# EAGLE design KeyJam Header (EAGLE 9.6.2)
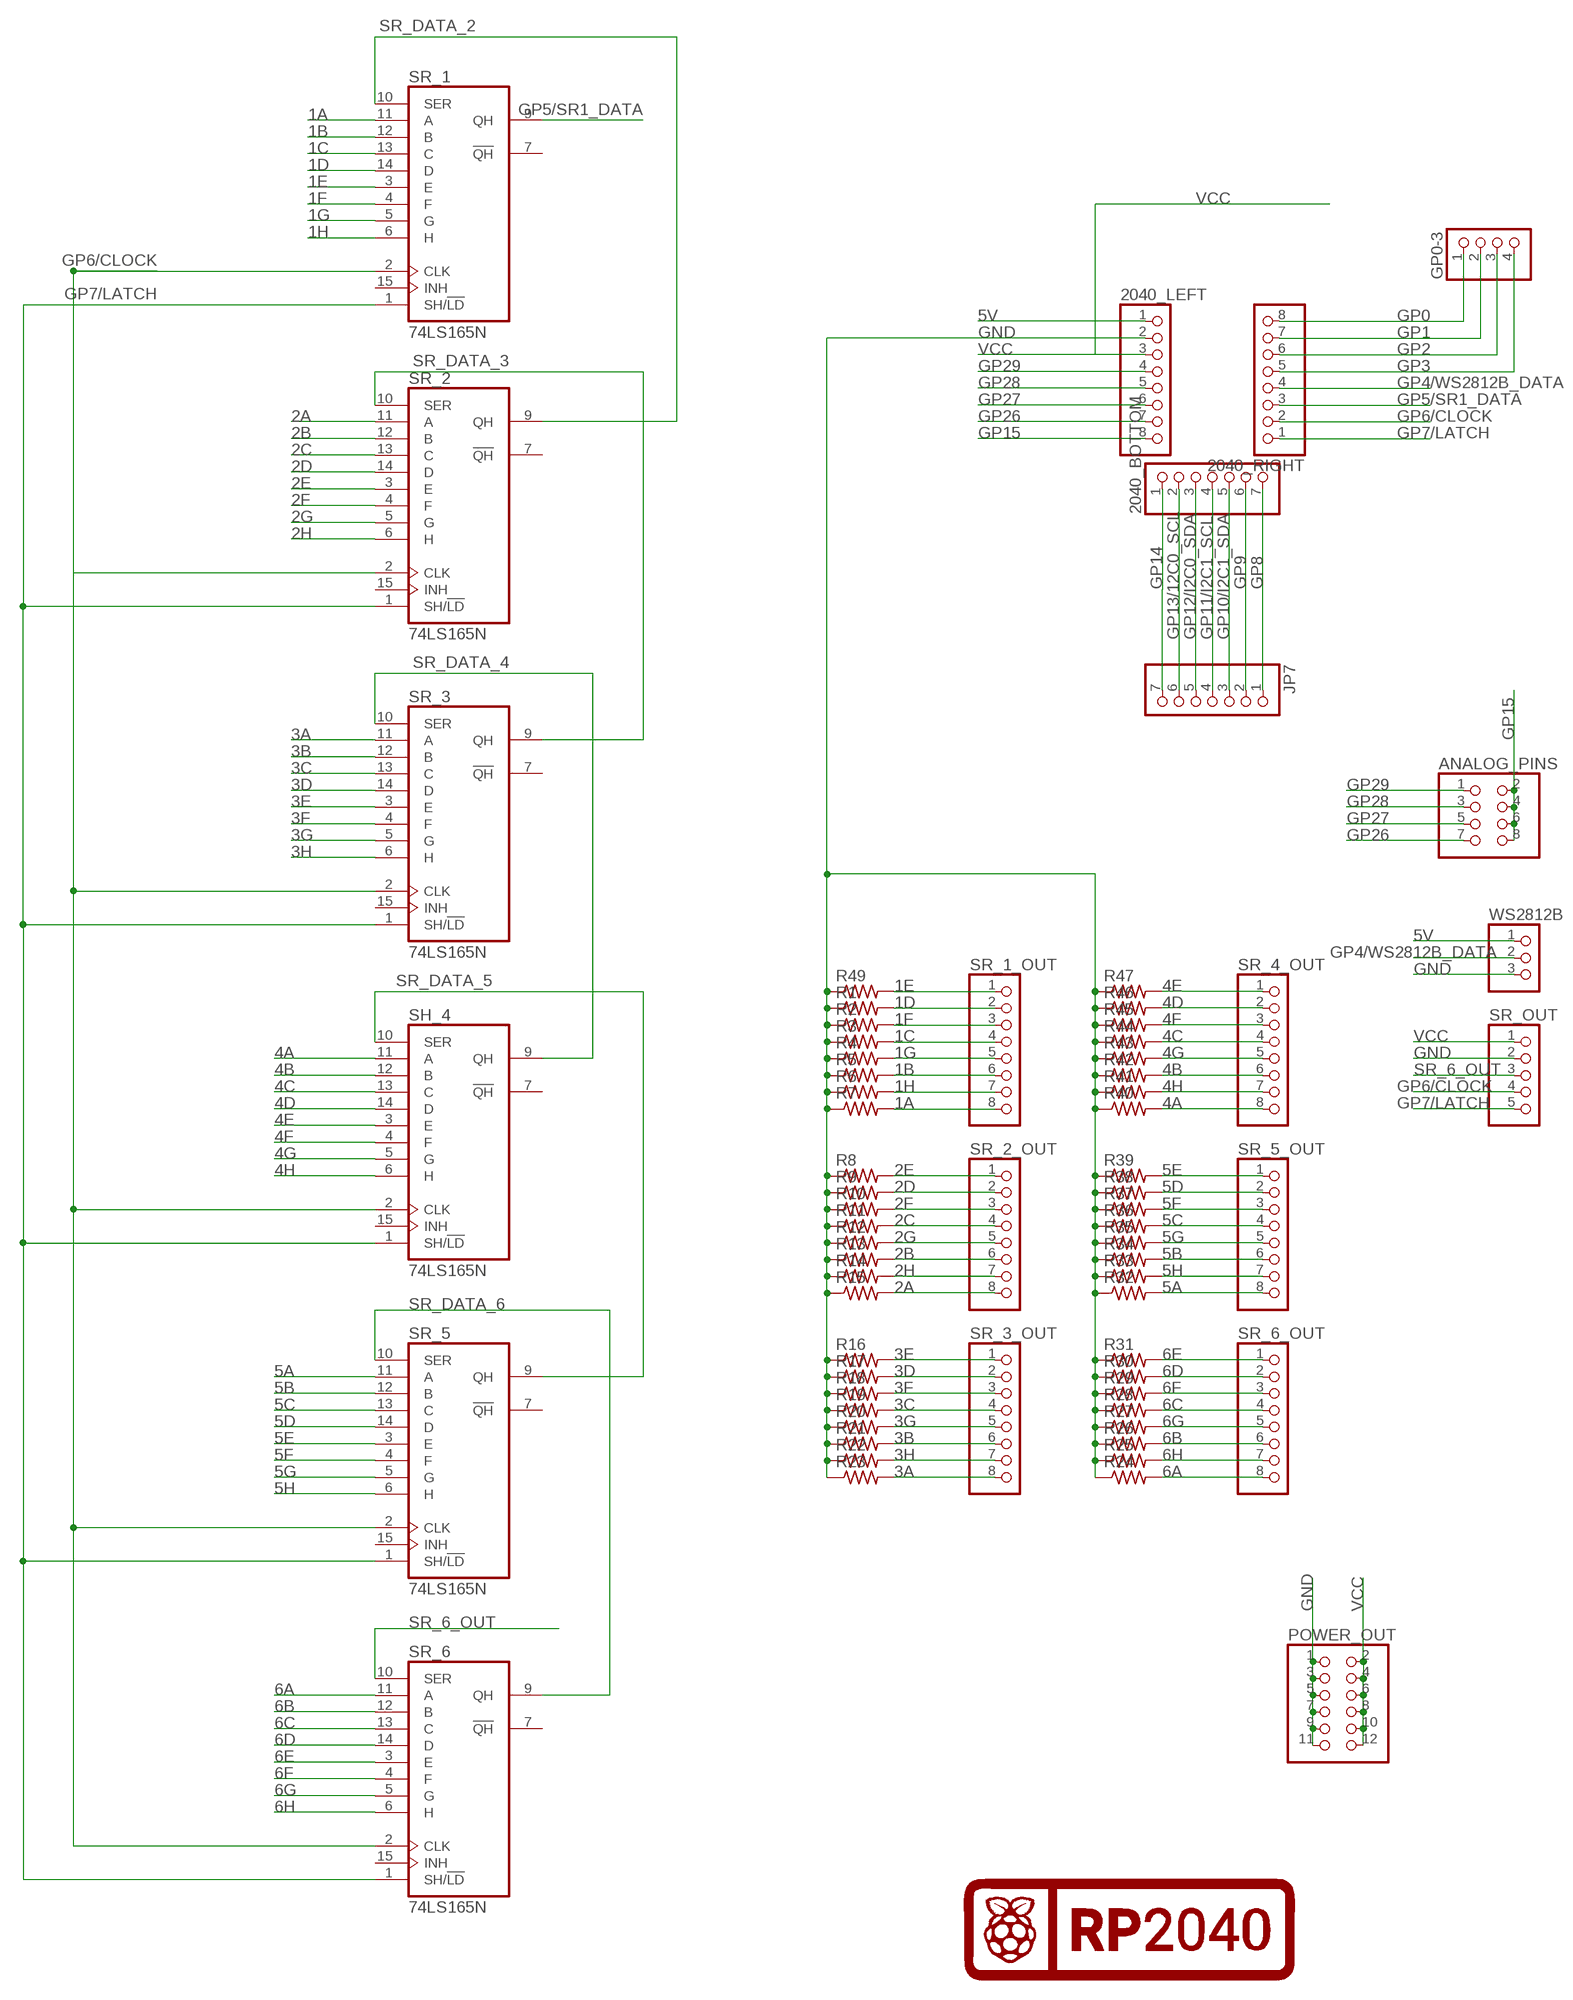
[diagram p0: schematic, sheet 1]

## Parts
2040_BOTTOM  PINHD-1X7  [1X07]
2040_LEFT  PINHD-1X8  [1X08]
2040_RIGHT  PINHD-1X8  [1X08]
ANALOG_PINS  PINHD-2X4  [2X04]
GP0-3  PINHD-1X4  [1X04]
JP7  PINHD-1X7  [1X07]
POWER_OUT  PINHD-2X6  [2X06]
R1  R-US_R1206  [R1206]
R2  R-US_R1206  [R1206]
R3  R-US_R1206  [R1206]
R4  R-US_R1206  [R1206]
R5  R-US_R1206  [R1206]
R6  R-US_R1206  [R1206]
R7  R-US_R1206  [R1206]
R8  R-US_R1206  [R1206]
R9  R-US_R1206  [R1206]
R10  R-US_R1206  [R1206]
R11  R-US_R1206  [R1206]
R12  R-US_R1206  [R1206]
R13  R-US_R1206  [R1206]
R14  R-US_R1206  [R1206]
R15  R-US_R1206  [R1206]
R16  R-US_R1206  [R1206]
R17  R-US_R1206  [R1206]
R18  R-US_R1206  [R1206]
R19  R-US_R1206  [R1206]
R20  R-US_R1206  [R1206]
R21  R-US_R1206  [R1206]
R22  R-US_R1206  [R1206]
R23  R-US_R1206  [R1206]
R24  R-US_R1206  [R1206]
R25  R-US_R1206  [R1206]
R26  R-US_R1206  [R1206]
R27  R-US_R1206  [R1206]
R28  R-US_R1206  [R1206]
R29  R-US_R1206  [R1206]
R30  R-US_R1206  [R1206]
R31  R-US_R1206  [R1206]
R32  R-US_R1206  [R1206]
R33  R-US_R1206  [R1206]
R34  R-US_R1206  [R1206]
R35  R-US_R1206  [R1206]
R36  R-US_R1206  [R1206]
R37  R-US_R1206  [R1206]
R38  R-US_R1206  [R1206]
R39  R-US_R1206  [R1206]
R40  R-US_R1206  [R1206]
R41  R-US_R1206  [R1206]
R42  R-US_R1206  [R1206]
R43  R-US_R1206  [R1206]
R44  R-US_R1206  [R1206]
R45  R-US_R1206  [R1206]
R46  R-US_R1206  [R1206]
R47  R-US_R1206  [R1206]
R49  R-US_R1206  [R1206]
SH_4  74LS165N  [DIL16]
SR_1  74LS165N  [DIL16]
SR_1_OUT  PINHD-1X8  [1X08]
SR_2  74LS165N  [DIL16]
SR_2_OUT  PINHD-1X8  [1X08]
SR_3  74LS165N  [DIL16]
SR_3_OUT  PINHD-1X8  [1X08]
SR_4_OUT  PINHD-1X8  [1X08]
SR_5  74LS165N  [DIL16]
SR_5_OUT  PINHD-1X8  [1X08]
SR_6  74LS165N  [DIL16]
SR_6_OUT  PINHD-1X8  [1X08]
SR_OUT  PINHD-1X5  [1X05]
U$1  RASPI_RP2040_LOGO_20MM  [RASPI_RP2040_LOGO_20MM]
WS2812B  PINHD-1X3  [1X03]

## Nets
1A: R7.2 SR_1.11(A) SR_1_OUT.8
1B: R5.2 SR_1.12(B) SR_1_OUT.6
1C: R3.2 SR_1.13(C) SR_1_OUT.4
1D: R1.2 SR_1.14(D) SR_1_OUT.2
1E: R49.2 SR_1.3(E) SR_1_OUT.1
1F: R2.2 SR_1.4(F) SR_1_OUT.3
1G: R4.2 SR_1.5(G) SR_1_OUT.5
1H: R6.2 SR_1.6(H) SR_1_OUT.7
2A: R15.2 SR_2.11(A) SR_2_OUT.8
2B: R13.2 SR_2.12(B) SR_2_OUT.6
2C: R11.2 SR_2.13(C) SR_2_OUT.4
2D: R9.2 SR_2.14(D) SR_2_OUT.2
2E: R8.2 SR_2.3(E) SR_2_OUT.1
2F: R10.2 SR_2.4(F) SR_2_OUT.3
2G: R12.2 SR_2.5(G) SR_2_OUT.5
2H: R14.2 SR_2.6(H) SR_2_OUT.7
3A: R23.2 SR_3.11(A) SR_3_OUT.8
3B: R21.2 SR_3.12(B) SR_3_OUT.6
3C: R19.2 SR_3.13(C) SR_3_OUT.4
3D: R17.2 SR_3.14(D) SR_3_OUT.2
3E: R16.2 SR_3.3(E) SR_3_OUT.1
3F: R18.2 SR_3.4(F) SR_3_OUT.3
3G: R20.2 SR_3.5(G) SR_3_OUT.5
3H: R22.2 SR_3.6(H) SR_3_OUT.7
4A: R40.2 SH_4.11(A) SR_4_OUT.8
4B: R42.2 SH_4.12(B) SR_4_OUT.6
4C: R44.2 SH_4.13(C) SR_4_OUT.4
4D: R46.2 SH_4.14(D) SR_4_OUT.2
4E: R47.2 SH_4.3(E) SR_4_OUT.1
4F: R45.2 SH_4.4(F) SR_4_OUT.3
4G: R43.2 SH_4.5(G) SR_4_OUT.5
4H: R41.2 SH_4.6(H) SR_4_OUT.7
5A: R32.2 SR_5.11(A) SR_5_OUT.8
5B: R34.2 SR_5.12(B) SR_5_OUT.6
5C: R36.2 SR_5.13(C) SR_5_OUT.4
5D: R38.2 SR_5.14(D) SR_5_OUT.2
5E: R39.2 SR_5.3(E) SR_5_OUT.1
5F: R37.2 SR_5.4(F) SR_5_OUT.3
5G: R35.2 SR_5.5(G) SR_5_OUT.5
5H: R33.2 SR_5.6(H) SR_5_OUT.7
5V: 2040_LEFT.1 WS2812B.1
6A: R24.2 SR_6.11(A) SR_6_OUT.8
6B: R26.2 SR_6.12(B) SR_6_OUT.6
6C: R28.2 SR_6.13(C) SR_6_OUT.4
6D: R30.2 SR_6.14(D) SR_6_OUT.2
6E: R31.2 SR_6.3(E) SR_6_OUT.1
6F: R29.2 SR_6.4(F) SR_6_OUT.3
6G: R27.2 SR_6.5(G) SR_6_OUT.5
6H: R25.2 SR_6.6(H) SR_6_OUT.7
GND: 2040_LEFT.2 POWER_OUT.1 POWER_OUT.3 POWER_OUT.5 POWER_OUT.7 POWER_OUT.9 POWER_OUT.11 R1.1 R2.1 R3.1 R4.1 R5.1 R6.1 R7.1 R8.1 R9.1 R10.1 R11.1 R12.1 R13.1 R14.1 R15.1 R16.1 R17.1 R18.1 R19.1 R20.1 R21.1 R22.1 R23.1 R24.1 R25.1 R26.1 R27.1 R28.1 R29.1 R30.1 R31.1 R32.1 R33.1 R34.1 R35.1 R36.1 R37.1 R38.1 R39.1 R40.1 R41.1 R42.1 R43.1 R44.1 R45.1 R46.1 R47.1 R49.1 SR_OUT.2 WS2812B.3
GP0: 2040_RIGHT.8 GP0-3.1
GP1: 2040_RIGHT.7 GP0-3.2
GP2: 2040_RIGHT.6 GP0-3.3
GP3: 2040_RIGHT.5 GP0-3.4
GP4/WS2812B_DATA: 2040_RIGHT.4 WS2812B.2
GP5/SR1_DATA: 2040_RIGHT.3 SR_1.9(QH)
GP6/CLOCK: 2040_RIGHT.2 SH_4.2(CLK) SR_1.2(CLK) SR_2.2(CLK) SR_3.2(CLK) SR_5.2(CLK) SR_6.2(CLK) SR_OUT.4
GP7/LATCH: 2040_RIGHT.1 SH_4.1(SH/!LD) SR_1.1(SH/!LD) SR_2.1(SH/!LD) SR_3.1(SH/!LD) SR_5.1(SH/!LD) SR_6.1(SH/!LD) SR_OUT.5
GP8: 2040_BOTTOM.7 JP7.1
GP9: 2040_BOTTOM.6 JP7.2
GP10/I2C1_SDA: 2040_BOTTOM.5 JP7.3
GP11/I2C1_SCL: 2040_BOTTOM.4 JP7.4
GP12/I2C0_SDA: 2040_BOTTOM.3 JP7.5
GP13/12C0_SCL: 2040_BOTTOM.2 JP7.6
GP14: 2040_BOTTOM.1 JP7.7
GP15: 2040_LEFT.8 ANALOG_PINS.2 ANALOG_PINS.4 ANALOG_PINS.6 ANALOG_PINS.8
GP26: 2040_LEFT.7 ANALOG_PINS.7
GP27: 2040_LEFT.6 ANALOG_PINS.5
GP28: 2040_LEFT.5 ANALOG_PINS.3
GP29: 2040_LEFT.4 ANALOG_PINS.1
SR_6_OUT: SR_6.10(SER) SR_OUT.3
SR_DATA_2: SR_1.10(SER) SR_2.9(QH)
SR_DATA_3: SR_2.10(SER) SR_3.9(QH)
SR_DATA_4: SH_4.9(QH) SR_3.10(SER)
SR_DATA_5: SH_4.10(SER) SR_5.9(QH)
SR_DATA_6: SR_5.10(SER) SR_6.9(QH)
VCC: 2040_LEFT.3 POWER_OUT.2 POWER_OUT.4 POWER_OUT.6 POWER_OUT.8 POWER_OUT.10 POWER_OUT.12 SR_OUT.1
Unconnected: SH_4.7(!QH) SH_4.15(INH) SR_1.7(!QH) SR_1.15(INH) SR_2.7(!QH) SR_2.15(INH) SR_3.7(!QH) SR_3.15(INH) SR_5.7(!QH) SR_5.15(INH) SR_6.7(!QH) SR_6.15(INH)

## Power pins joined to a net without a drawn wire
GND: SH_4.8(GND) SR_1.8(GND) SR_2.8(GND) SR_3.8(GND) SR_5.8(GND) SR_6.8(GND)
VCC: SH_4.16(VCC) SR_1.16(VCC) SR_2.16(VCC) SR_3.16(VCC) SR_5.16(VCC) SR_6.16(VCC)

## Library data of the parts
2040_BOTTOM JP7 = pinhead:PINHD-1X7: PIN HEADER
2040_LEFT 2040_RIGHT SR_1_OUT SR_2_OUT SR_3_OUT SR_4_OUT SR_5_OUT SR_6_OUT = pinhead:PINHD-1X8: PIN HEADER
ANALOG_PINS = pinhead:PINHD-2X4: PIN HEADER
GP0-3 = pinhead:PINHD-1X4: PIN HEADER
POWER_OUT = pinhead:PINHD-2X6: PIN HEADER
R1-R47 R49 = adafruit:R-US_: RESISTOR, American symbol
SH_4 SR_1-SR_3 SR_5 SR_6 = 74xx-us:74*165: 8-bit parallel load SHIFT REGISTER
SR_OUT = pinhead:PINHD-1X5: PIN HEADER
U$1 = SparkFun-Aesthetics:RASPI_RP2040_LOGO
WS2812B = pinhead:PINHD-1X3: PIN HEADER

## Board
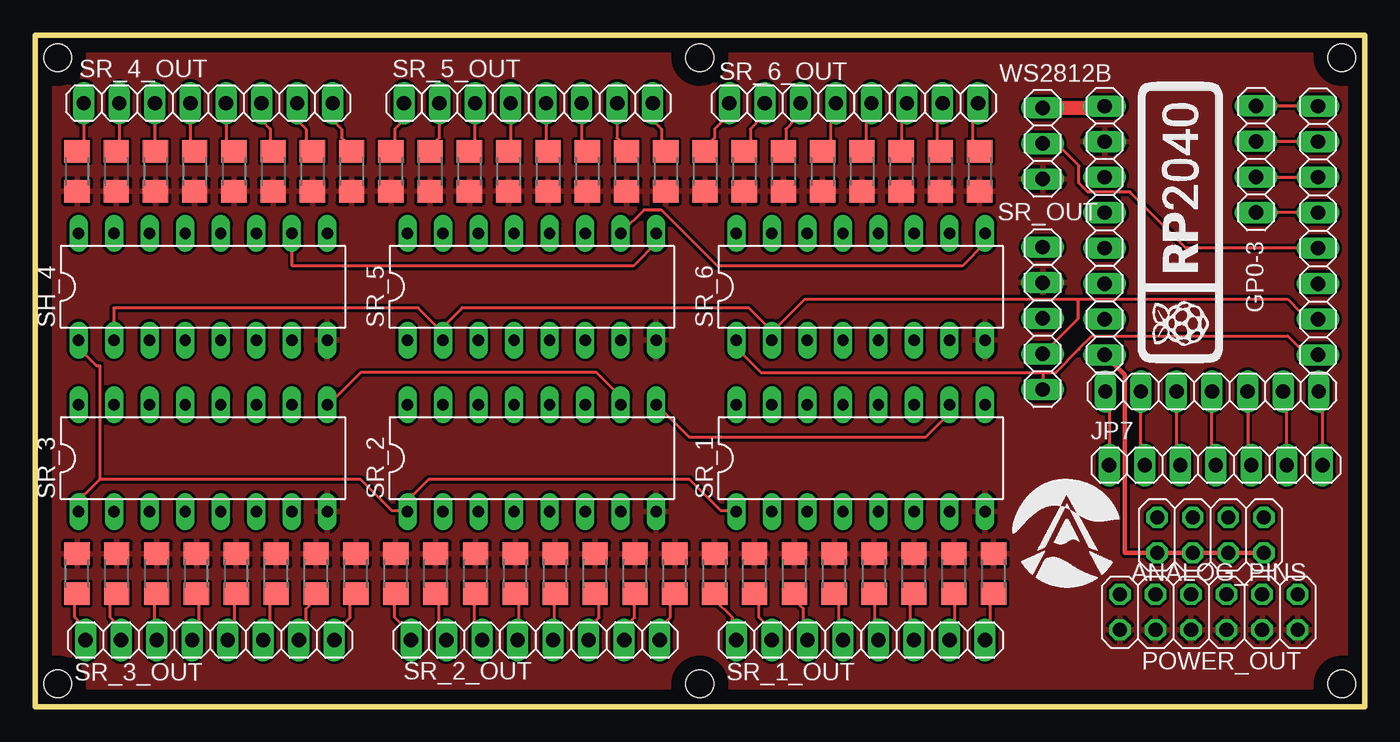
[diagram p1: board, top side]
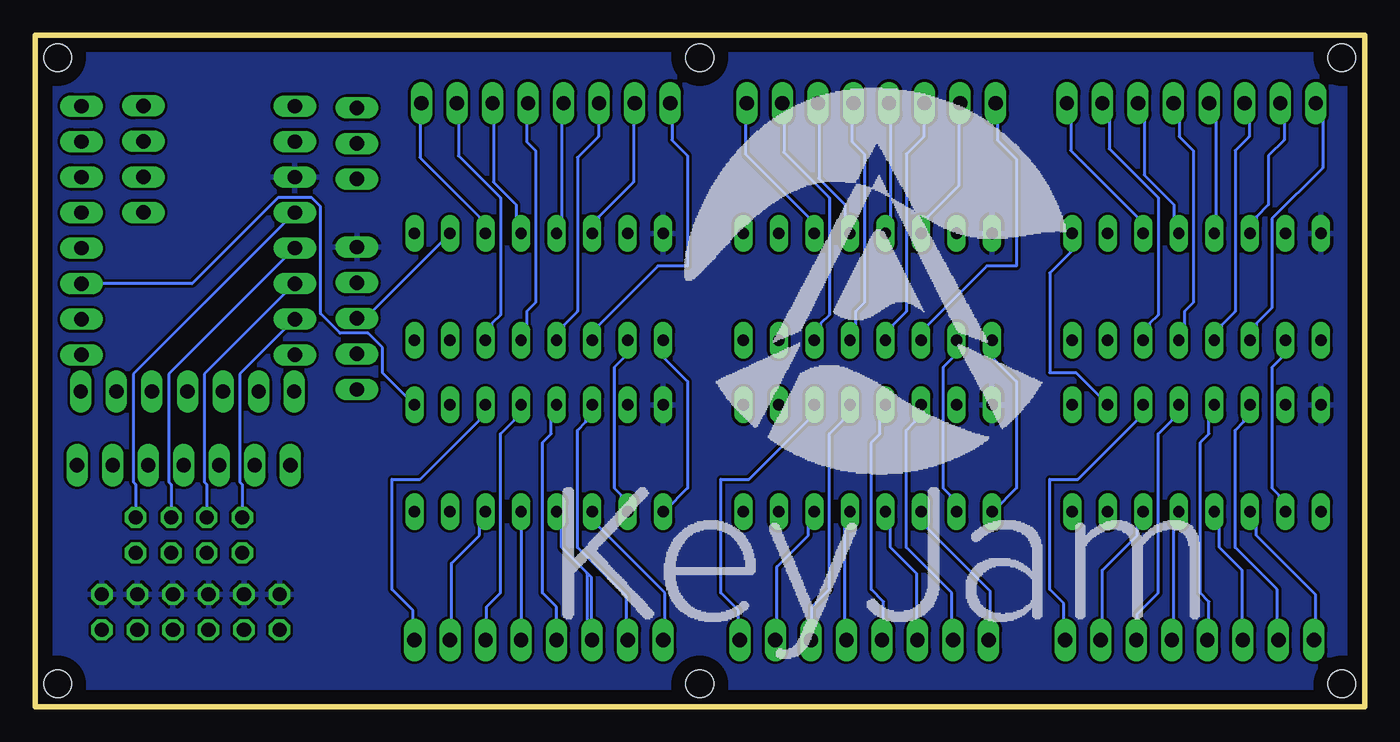
[diagram p2: board, bottom side, seen from below]

Size 95 x 48 mm. Coordinates in mm from the lower left corner, seen from the top.
Outline: 0,0 0,48 95,48 95,0 0,0
Copper layers (1*16): Top 0.035mm / dielectric 1.5mm / Bottom 0.035mm
Design rules "default *": minimum track width 8mil, minimum drill 0.35mm, track to track 8mil, track to pad 8mil, pad to pad 8mil, via to via 8mil, smd to smd 6mil, copper to edge 40mil, drill to drill 6mil, minimum pad ring 10mil, minimum via ring 8mil, stop-mask expansion 4mil, vias tented up to drill 0mil, thermal gap 10mil
Holes 2 mm at 1.62,46.38 93.38,1.62 93.38,46.38 1.62,1.62 47.5,1.62 47.5,46.38

### Footprints (pad centres in the part's own frame; a part is rotated, then mirrored left to right if it is on the bottom)
1X07 = drill 1.016 long: 1 -7.62,0; 2 -5.08,0; 3 -2.54,0; 4 0,0; 5 2.54,0; 6 5.08,0; 7 7.62,0
1X08 = drill 1.016 long: 1 -8.89,0; 2 -6.35,0; 3 -3.81,0; 4 -1.27,0; 5 1.27,0; 6 3.81,0; 7 6.35,0; 8 8.89,0
2X04 = drill 1.016 octagon: 1 -3.81,-1.27; 2 -3.81,1.27; 3 -1.27,-1.27; 4 -1.27,1.27; 5 1.27,-1.27; 6 1.27,1.27; 7 3.81,-1.27; 8 3.81,1.27
1X04 = drill 1.016 long: 1 -3.81,0; 2 -1.27,0; 3 1.27,0; 4 3.81,0
2X06 = drill 1.016 octagon: 1 -6.35,-1.27; 2 -6.35,1.27; 3 -3.81,-1.27; 4 -3.81,1.27; 5 -1.27,-1.27; 6 -1.27,1.27; 7 1.27,-1.27; 8 1.27,1.27; 9 3.81,-1.27; 10 3.81,1.27; 11 6.35,-1.27; 12 6.35,1.27
R1206 = smd 1.6 x 1.803: 1 -1.422,0; 2 1.422,0
DIL16 = drill 0.813 long: 1 -8.89,-3.81; 2 -6.35,-3.81; 3 -3.81,-3.81; 4 -1.27,-3.81; 5 1.27,-3.81; 6 3.81,-3.81; 7 6.35,-3.81; 8 8.89,-3.81; 9 8.89,3.81; 10 6.35,3.81; 11 3.81,3.81; 12 1.27,3.81; 13 -1.27,3.81; 14 -3.81,3.81; 15 -6.35,3.81; 16 -8.89,3.81
1X05 = drill 1.016 long: 1 -5.08,0; 2 -2.54,0; 3 0,0; 4 2.54,0; 5 5.08,0
1X03 = drill 1.016 long: 1 -2.54,0; 2 0,0; 3 2.54,0

### Placement (x,y rotation side)
2040_BOTTOM  84.1,22.52 180 top
2040_LEFT  76.43,34.03 270 top
2040_RIGHT  91.67,34.03 90 top
ANALOG_PINS  84,12.25 180 top
GP0-3  87.25,39.12 270 top
JP7  84.38,17.25 0 top
POWER_OUT  83.88,6.75 0 top
R1  51.41,9.5 270 top
R2  54.26,9.5 270 top
R3  57.11,9.5 270 top
R4  59.96,9.5 270 top
R5  62.8,9.5 270 top
R6  65.65,9.5 270 top
R7  68.5,9.5 270 top
R8  25.78,9.5 270 top
R9  28.63,9.5 270 top
R10  31.48,9.5 270 top
R11  34.33,9.5 270 top
R12  37.17,9.5 270 top
R13  40.02,9.5 270 top
R14  42.87,9.5 270 top
R15  45.72,9.5 270 top
R16  3,9.5 270 top
R17  5.85,9.5 270 top
R18  8.7,9.5 270 top
R19  11.54,9.5 270 top
R20  14.39,9.5 270 top
R21  17.24,9.5 270 top
R22  20.09,9.5 270 top
R23  22.93,9.5 270 top
R24  67.5,38.25 90 top
R25  64.7,38.25 90 top
R26  61.89,38.25 90 top
R27  59.09,38.25 90 top
R28  56.28,38.25 90 top
R29  53.48,38.25 90 top
R30  50.67,38.25 90 top
R31  47.87,38.25 90 top
R32  45.07,38.25 90 top
R33  42.26,38.25 90 top
R34  39.46,38.25 90 top
R35  36.65,38.25 90 top
R36  33.85,38.25 90 top
R37  31.04,38.25 90 top
R38  28.24,38.25 90 top
R39  25.43,38.25 90 top
R40  22.63,38.25 90 top
R41  19.83,38.25 90 top
R42  17.02,38.25 90 top
R43  14.22,38.25 90 top
R44  11.41,38.25 90 top
R45  8.61,38.25 90 top
R46  5.8,38.25 90 top
R47  3,38.25 90 top
R49  48.57,9.5 270 top
SH_4  12,30 0 top
SR_1  59,17.75 0 top
SR_1_OUT  59,4.75 0 top
SR_2  35.5,17.75 0 top
SR_2_OUT  35.75,4.75 0 top
SR_3  12,17.75 0 top
SR_3_OUT  12.5,4.75 0 top
SR_4_OUT  12.38,43.12 0 top
SR_5  35.5,30 0 top
SR_5_OUT  35.25,43.12 0 top
SR_6  59,30 0 top
SR_6_OUT  58.5,43.12 0 top
SR_OUT  72,27.75 270 top
U$1  81.85,34.56 90 top
WS2812B  72,40.25 270 top

### Tracks (layer width: path | path; a pad name or v marks a point on that pad's centre or on a via)
1A
  Top 0.203: 68,4.75 SR_1_OUT.8 68.26,5.09 68.26,7.63 R7.2
  Bottom 0.203: SR_1.11 62.88,21.5 63.25,21.13 63.25,20.5 67.5,16.25 69.5,16.25 69.5,8.38 68,6.88 68,4.75 SR_1_OUT.8
1B
  Top 0.203: 62.88,4.75 SR_1_OUT.6 62.54,5.09 62.54,7.63 R5.2
  Bottom 0.203: SR_1.12 60.38,21.5 60.75,21.13 60.75,20.5 61.75,19.5 61.75,8.13 62.75,7.13 62.75,4.75 SR_1_OUT.6
1C
  Top 0.203: 57.88,4.75 SR_1_OUT.4 57.46,5.09 57.46,7.63 R3.2
  Bottom 0.203: SR_1.13 57.75,21.5 58.13,21.13 58.13,19.5 58.75,18.88 58.75,8.13 57.75,7.13 57.75,4.75 SR_1_OUT.4
1D
  Top 0.203: 52.75,4.75 SR_1_OUT.2 52.38,5.09 52.38,5.73 51.75,6.36 51.75,7.63 R1.2
  Bottom 0.203: SR_1.14 55.63,21.13 55.63,20.38 56.25,19.75 56.25,11.38 52.75,7.88 52.75,4.75 SR_1_OUT.2
1E
  Top 0.203: 50,4.75 SR_1_OUT.1 49.84,5.09 49.84,6.36 48.57,7.63 R49.2
  Bottom 0.203: SR_1.3 54.75,13.5 54.75,12.88 50,8.13 50,4.75 SR_1_OUT.1
1F
  Top 0.203: R2.2 54.29,7.63 54.92,7 54.92,5.09 SR_1_OUT.3
  Bottom 0.203: 55.55,9.55 55.25,9.25 55.25,4.25 | 55.55,9.55 57.38,11.38 57.38,13.63 57.63,13.88 SR_1.4 | SR_1_OUT.3 55.56,5.09 55.56,9.54 55.55,9.55
1G
  Top 0.203: R4.2 60,7.63 60,5.09 SR_1_OUT.5
  Bottom 0.203: SR_1.5 SR_1_OUT.5
1H
  Top 0.203: 65.5,4.75 SR_1_OUT.7 65.72,5.09 65.72,7.63 R6.2
  Bottom 0.203: SR_1.6 63.25,13.5 63.25,12.25 65.25,10.25 65.25,4.75 SR_1_OUT.7
2A
  Top 0.203: 44.5,4.75 SR_2_OUT.8 44.76,5.09 44.76,5.73 45.4,6.36 45.4,7.63 R15.2
  Bottom 0.203: SR_2.11 39.38,21.5 39.75,21.13 39.75,20.5 44,16.25 46,16.25 46,8.13 44.75,6.88 44.75,4.75 SR_2_OUT.8
2B
  Top 0.203: 39.49,4.75 SR_2_OUT.6 39.68,5.09 39.68,5.73 40.32,6.36 40.32,7.63 R13.2
  Bottom 0.203: SR_2.12 36.88,21.5 37.25,21.13 37.25,20.5 38.25,19.5 38.25,8.38 39.5,7.13 39.5,4.75 SR_2_OUT.6
2C
  Top 0.203: SR_2_OUT.4 34.6,5.09 34.6,7.63 R11.2
  Bottom 0.203: SR_2.13 34.25,21.5 34.63,21.13 34.63,19.5 35.25,18.88 35.25,8.38 34.38,7.5 34.38,4.75 SR_2_OUT.4
2D
  Top 0.203: 29.46,4.75 SR_2_OUT.2 28.89,5.09 28.89,7.63 R9.2
  Bottom 0.203: SR_2.14 32.13,21.13 32.13,20.38 32.75,19.75 32.75,11.38 29.5,8.13 29.5,4.75 SR_2_OUT.2
2E
  Top 0.203: 26.75,4.75 SR_2_OUT.1 26.35,5.09 26.35,5.73 25.71,6.36 25.71,7.63 R8.2
  Bottom 0.203: SR_2.3 31.25,13.5 31.25,12.75 26.75,8.25 26.75,4.75 SR_2_OUT.1
2F
  Top 0.203: 31.97,4.75 SR_2_OUT.3 31.43,5.09 31.43,7.63 R10.2
  Bottom 0.203: SR_2.4 34.13,13.88 33.88,13.63 33.88,11.38 32,9.5 32,4.75 SR_2_OUT.3
2G
  Top 0.203: 36.98,4.75 SR_2_OUT.5 37.14,5.09 37.14,7.63 R12.2
  Bottom 0.203: SR_2.5 36.88,13.88 37.13,13.63 37.13,4.75 SR_2_OUT.5
2H
  Top 0.203: 41.99,4.75 SR_2_OUT.7 42.22,5.09 42.22,5.73 42.86,6.36 42.86,7.63 R14.2
  Bottom 0.203: SR_2.6 39.75,13.5 39.75,12.25 42,10 42,4.75 SR_2_OUT.7
3A
  Top 0.203: 21.5,4.75 SR_3_OUT.8 21.9,5.09 21.9,5.73 22.54,6.36 22.54,7.63 R23.2
  Bottom 0.203: SR_3.11 15.88,21.5 16.25,21.13 16.25,20.5 20.5,16.25 22.5,16.25 22.5,8.38 21.5,7.38 21.5,4.75 SR_3_OUT.8
3B
  Top 0.203: 16,4.75 SR_3_OUT.6 16.82,5.09 16.82,7.63 R21.2
  Bottom 0.203: SR_3.12 13.38,21.5 13.75,21.13 13.75,20.5 14.75,19.5 14.75,8.13 16.25,6.63 16.25,4.75 SR_3_OUT.6
3C
  Top 0.203: 11,4.75 SR_3_OUT.4 11.74,5.09 11.74,7.63 R19.2
  Bottom 0.203: 11.13,4.75 11.13,5.09 | 11.13,5.09 11.13,7.5 11.75,8.13 11.75,18.88 11.13,19.5 11.13,21.13 10.75,21.5 SR_3.13 | SR_3_OUT.4 11.11,5.09 11.13,5.09
3D
  Top 0.203: 6,4.75 SR_3_OUT.2 6.03,5.09 6.03,5.73 5.39,6.36 5.39,7.63 R17.2
  Bottom 0.203: SR_3.14 8.63,21.13 8.63,20.38 9.25,19.75 9.25,11.38 6.25,8.38 6.25,4.75 SR_3_OUT.2
3E
  Top 0.203: 3.5,4.75 SR_3_OUT.1 3.49,5.09 3.49,5.73 2.85,6.36 2.85,7.63 R16.2
  Bottom 0.203: SR_3.3 7.75,13.5 7.75,12.25 3.5,8 3.5,4.75 SR_3_OUT.1
3F
  Top 0.203: 8.5,4.75 SR_3_OUT.3 8.57,5.09 8.57,7.63 R18.2
  Bottom 0.203: SR_3.4 10.63,13.88 10.38,13.63 10.38,11.38 8.75,9.75 8.75,4.75 SR_3_OUT.3
3G
  Top 0.203: R20.2 14.28,7.63 14.28,5.09 SR_3_OUT.5
  Bottom 0.203: SR_3.5 13.38,13.88 13.63,13.63 13.63,4.88 13.75,4.75 SR_3_OUT.5
3H
  Top 0.203: 18.5,4.75 SR_3_OUT.7 19.36,5.09 19.36,7 20,7.63 R22.2
  Bottom 0.203: SR_3.6 16.25,13.5 16.25,12.25 18.75,9.75 18.75,4.75 SR_3_OUT.7
4A
  Top 0.203: SR_4_OUT.8 21.27,41.92 21.9,41.29 21.9,40.65 22.54,40.02 R40.2
  Bottom 0.203: SH_4.11 16.25,34.25 16.25,35 21,39.75 21,43.13 SR_4_OUT.8
4B
  Top 0.203: SR_4_OUT.6 16.19,41.92 16.82,41.29 16.82,40.02 R42.2
  Bottom 0.203: SH_4.12 13.38,33.88 13.63,34.13 13.63,35.88 15.75,38 15.75,43.13 SR_4_OUT.6
4C
  Top 0.203: SR_4_OUT.4 11.11,40.02 R44.2
  Bottom 0.203: SH_4.13 10.63,33.88 10.63,43.13 SR_4_OUT.4
4D
  Top 0.203: SR_4_OUT.2 6.03,40.02 R46.2
  Bottom 0.203: SH_4.14 7.75,34.25 7.75,35 6.88,35.88 6.88,39.38 5.75,40.5 5.75,43.13 SR_4_OUT.2
4E
  Top 0.203: SR_4_OUT.1 3.49,40.02 R47.2
  Bottom 0.203: SH_4.3 8.13,26.25 7.75,26.63 7.75,27.38 6.63,28.5 6.63,34.88 3,38.5 3,43.13 SR_4_OUT.1
4F
  Top 0.203: SR_4_OUT.3 8.57,40.02 R45.2
  Bottom 0.203: SH_4.4 10.63,26.25 10.25,26.63 10.25,27.25 9.25,28.25 9.25,39.75 8.25,40.75 8.25,43.13 SR_4_OUT.3
4G
  Top 0.203: SR_4_OUT.5 13.65,40.02 R43.2
  Bottom 0.203: SH_4.5 13.25,26.25 12.88,26.63 12.88,28.25 12.25,28.88 12.25,39.75 13.25,40.75 13.25,43.13 SR_4_OUT.5
4H
  Top 0.203: SR_4_OUT.7 18.73,41.92 19.36,41.29 19.36,40.02 R41.2
  Bottom 0.203: SH_4.6 15.38,26.63 15.38,27.38 14.75,28 14.75,36.38 18.25,39.88 18.25,43.13 SR_4_OUT.7
5A
  Top 0.203: R32.2 44.76,40.02 44.76,41.29 44.13,41.92 44.13,42.56 SR_5_OUT.8
  Bottom 0.203: SR_5.11 39.75,34.25 39.75,35 44.25,39.5 44.25,43.13 SR_5_OUT.8
5B
  Top 0.203: R34.2 39.05,40.02 39.05,42.56 SR_5_OUT.6
  Bottom 0.203: SR_5.12 36.88,33.88 37.13,34.13 37.13,35.88 39,37.75 39,43.13 SR_5_OUT.6
5C
  Top 0.203: R36.2 33.97,40.02 33.97,42.56 SR_5_OUT.4
  Bottom 0.203: SR_5.13 34.13,33.88 33.88,34.13 33.88,43.13 SR_5_OUT.4
5D
  Top 0.203: R38.2 28.25,40.02 28.89,40.65 28.89,42.56 SR_5_OUT.2
  Bottom 0.203: SR_5.14 31.25,34.25 31.25,35 29,37.25 29,43.13 SR_5_OUT.2
5E
  Top 0.203: R39.2 25.71,40.02 25.71,41.29 26.35,41.92 26.35,42.56 SR_5_OUT.1
  Bottom 0.203: SR_5.3 31.63,26.25 31.25,26.63 31.25,27.25 27,31.5 24.88,31.5 24.88,39.13 26.25,40.5 26.25,43.13 SR_5_OUT.1
5F
  Top 0.203: R37.2 31.43,40.02 31.43,42.56 SR_5_OUT.3
  Bottom 0.203: SR_5.4 34.13,26.25 33.75,26.63 33.75,27.25 32.75,28.25 32.75,39.5 31.5,40.75 31.5,43.13 SR_5_OUT.3
5G
  Top 0.203: R35.2 36.51,40.02 36.51,42.56 SR_5_OUT.5
  Bottom 0.203: SR_5.5 36.75,26.25 36.38,26.63 36.38,28.25 35.75,28.88 35.75,39.5 36.63,40.38 36.63,43.13 SR_5_OUT.5
5H
  Top 0.203: R33.2 42.22,40.02 41.59,40.65 41.59,42.56 SR_5_OUT.7
  Bottom 0.203: SR_5.6 38.88,26.63 38.88,27.38 38.25,28 38.25,36.38 41.5,39.63 41.5,43.13 SR_5_OUT.7
5V
  Top 1.016: WS2812B.1 76.31,42.79 2040_LEFT.1
6A
  Top 0.203: R24.2 66.99,40.02 66.99,42.56 SR_6_OUT.8
  Bottom 0.203: SR_6.11 63.25,34.25 63.25,35 67.5,39.25 67.5,43.13 SR_6_OUT.8
6B
  Top 0.203: R26.2 61.91,40.02 61.91,42.56 SR_6_OUT.6
  Bottom 0.203: SR_6.12 60.38,33.88 60.63,34.13 60.63,35.88 62.25,37.5 62.25,43.13 SR_6_OUT.6
6C
  Top 0.203: R28.2 56.83,40.02 56.83,42.56 SR_6_OUT.4
  Bottom 0.203: SR_6.13 57.63,33.88 57.38,34.13 57.38,43 57.25,43.13 SR_6_OUT.4
6D
  Top 0.203: R30.2 51.11,40.02 51.11,41.29 51.75,41.92 51.75,42.56 SR_6_OUT.2
  Bottom 0.203: SR_6.14 54.75,34.25 54.75,35 52.25,37.5 52.25,43.13 SR_6_OUT.2
6E
  Top 0.203: R31.2 47.94,40.02 48.57,40.65 48.57,41.29 49.21,41.92 49.21,42.56 SR_6_OUT.1
  Bottom 0.203: SR_6.3 55.13,26.25 54.75,26.63 54.75,27.25 50.5,31.5 48.38,31.5 48.38,39.38 49.5,40.5 49.5,43.13 SR_6_OUT.1
6F
  Top 0.203: R29.2 53.65,40.02 53.65,41.29 54.29,41.92 54.29,42.56 SR_6_OUT.3
  Bottom 0.203: SR_6.4 57.63,26.25 57.25,26.63 57.25,27.25 56.25,28.25 56.25,39.25 54.75,40.75 54.75,43.13 SR_6_OUT.3
6G
  Top 0.203: R27.2 59.37,40.02 59.37,42.56 SR_6_OUT.5
  Bottom 0.203: SR_6.5 60.25,26.25 59.88,26.63 59.88,28.25 59.25,28.88 59.25,39.75 59.88,40.38 59.88,43.13 SR_6_OUT.5
6H
  Top 0.203: R25.2 64.45,40.02 64.45,42.56 SR_6_OUT.7
  Bottom 0.203: SR_6.6 62.38,26.63 62.38,27.38 61.75,28 61.75,36.38 64.75,39.38 64.75,43.13 SR_6_OUT.7
GND
  pour Top: -1.86,48.75 95.5,48.75 95.5,-0.75 -1.86,-0.75
GP0
  Top 0.203: GP0-3.1 91.66,42.94 2040_RIGHT.8
GP1
  Top 0.203: 2040_RIGHT.7 87.27,40.38 GP0-3.2
GP2
  Top 0.203: GP0-3.3 91.66,37.86 2040_RIGHT.6
GP3
  Top 0.203: 2040_RIGHT.5 87.27,35.3 GP0-3.4
GP4/WS2812B_DATA
  Top 0.203: WS2812B.2 73,40.25 74.61,38.64 74.61,37.4 75.23,36.77 78.23,36.77 82.25,32.76 2040_RIGHT.4
GP5/SR1_DATA
  Bottom 0.203: SR_1.9 70.17,23.84 70.17,25.65 71.2,26.68 73.2,26.68 74.61,28.09 74.61,35.74 75.23,36.37 77.64,36.37 83.79,30.22 2040_RIGHT.3
GP6/CLOCK
  Top 0.203: SH_4.2 5.63,26.25 5.63,28.5 27.38,28.5 29.13,26.75 29.13,26.25 SR_5.2 29,27 30.5,28.5 51,28.5 52.5,27 52.75,27 SR_6.2 52.75,26.25 52.75,26.88 55,29.13 74.5,29.13 | 74.5,29.13 89.5,29.13 90.38,28.25 91.13,28.25 91.63,27.75 2040_RIGHT.2 | 74.5,29.13 74.5,27.71 SR_OUT.4
  Bottom 0.203: SR_3.2 5.75,14 6.13,14.38 6.13,15.13 6.63,15.63 6.63,24.25 5.75,25.13 5.75,26.13 SH_4.2 | SR_2.2 29.25,14 29.63,14.38 29.63,15.13 30.13,15.63 30.13,24.25 29.25,25.13 29.25,26.13 SR_5.2 | SR_1.2 52.75,14 53.13,14.38 53.13,15.13 53.63,15.63 53.63,24.25 52.75,25.13 52.75,26.13 SR_6.2
GP7/LATCH
  Top 0.203: 4.63,16.25 3.5,15.13 3.13,15.13 3.13,14 SR_3.1 | 4.63,16.25 4.63,24.38 4.38,24.38 3.13,25.63 3.13,26.13 SH_4.1 | 4.63,16.25 23.25,16.25 25.5,14 26.5,14 SR_2.1 26.63,14 26.63,15.13 27,15.13 28.13,16.25 46.75,16.25 49,14 50,14 SR_1.1 | 2040_RIGHT.1 91.63,25.25 91.13,25.75 90.25,25.75 89.5,26.5 75.52,26.5 74.61,25.58 74.61,25.55 72.94,23.88 72,23.88 | SR_6.1 50.13,26.13 50.13,25.63 51.88,23.88 72,23.88 | 72,23.88 SR_OUT.5
  Bottom 0.203: SR_2.1 26.5,14 24.88,15.63 24.88,23.25 26.63,25 26.63,26.13 SR_5.1 | SR_1.1 50,14 48.38,15.63 48.38,23.25 50.13,25 50.13,26.13 SR_6.1
GP8
  Top 0.203: 2040_BOTTOM.7 76.76,22.25 JP7.1
GP9
  Top 0.203: JP7.2 79.03,17.52 2040_BOTTOM.6
GP10/I2C1_SDA
  Top 0.203: 2040_BOTTOM.5 81.57,17.52 JP7.3
GP11/I2C1_SCL
  Top 0.203: JP7.4 84.11,17.52 2040_BOTTOM.4
GP12/I2C0_SDA
  Top 0.203: 2040_BOTTOM.3 86.65,17.52 JP7.5
GP13/12C0_SCL
  Top 0.203: JP7.6 89.46,22.25 2040_BOTTOM.2
GP14
  Top 0.203: 2040_BOTTOM.1 92,22.25 JP7.7
GP15
  Top 0.305: 2040_LEFT.8 77.87,23.71 77.87,18.17 77.88,18.16 77.88,10.98 ANALOG_PINS.8 ANALOG_PINS.6 ANALOG_PINS.4 ANALOG_PINS.2
GP26
  Bottom 0.203: ANALOG_PINS.7 80.19,15.87 80.36,16.05 80.36,23.75 2040_LEFT.7
GP27
  Bottom 0.203: ANALOG_PINS.5 82.73,15.87 82.9,16.05 82.9,23.75 2040_LEFT.6
GP28
  Bottom 0.203: ANALOG_PINS.3 85.27,15.87 85.44,16.05 85.44,23.75 2040_LEFT.5
GP29
  Bottom 0.203: ANALOG_PINS.1 87.81,15.87 87.98,16.05 87.98,23.75 2040_LEFT.4
SR_6_OUT
  Bottom 0.203: SR_6.10 71.41,27.75 SR_OUT.3
SR_DATA_2
  Top 0.203: SR_2.9 44.5,21.5 46.75,19.25 63.63,19.25 65.25,20.88 65.25,21.5 SR_1.10
SR_DATA_3
  Top 0.203: SR_3.9 21,21.63 23.25,23.88 40.13,23.88 41.75,22.25 41.75,21.63 SR_2.10
SR_DATA_4
  Bottom 0.203: SR_3.10 18.38,21.63 20.63,23.88 22.5,23.88 22.5,31 21,32.5 21,33.75 SH_4.9
SR_DATA_5
  Top 0.203: SH_4.10 18.38,33.75 18.38,31.5 42.75,31.5 44.38,33.13 44.38,33.75 SR_5.9
SR_DATA_6
  Top 0.203: SR_5.10 41.88,33.88 43.5,35.5 44.75,35.5 48.75,31.5 66.25,31.5 67.88,33.13 67.88,33.75 SR_6.9
VCC
  pour Bottom: -1,47.75 96,47.75 96,1.62 94.62,0.25 1.5,0.25 -1,2.75